# Altium schematic sheet DAC.SchDoc
size A4
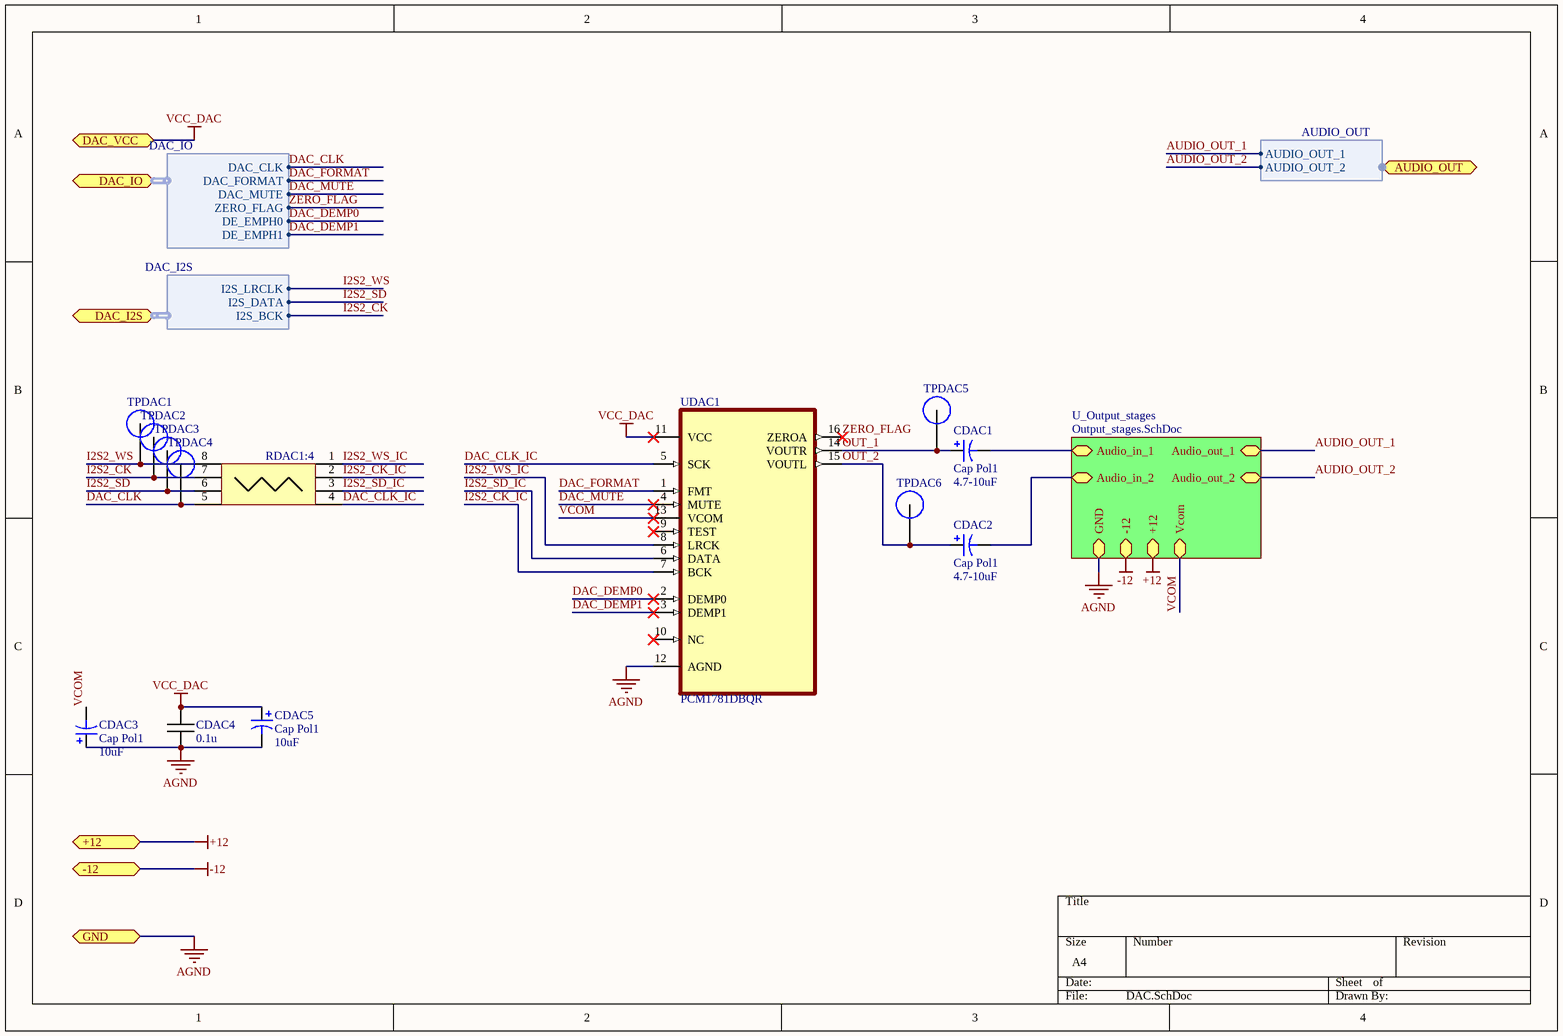
[diagram p0: DAC.SchDoc]

## Parts
CDAC1  Cap Pol1  value 4.7-10uF  [C-RAD-4.5]
CDAC2  Cap Pol1  value 4.7-10uF  [C-RAD-4.5]
CDAC3  Cap Pol1  value 10uF  [C-RAD-4.5]
CDAC4  0.1u  [C 0603 / 1608]
CDAC5  Cap Pol1  value 10uF  [C-RAD-4.5]
RDAC1:4  742C083121JP  [RESARRAY(4x0603)]  (value not drawn)
TPDAC1  Test Point  [Test POint]  (value not drawn)
TPDAC2  Test Point  [Test POint]  (value not drawn)
TPDAC3  Test Point  [Test POint]  (value not drawn)
TPDAC4  Test Point  [Test POint]  (value not drawn)
TPDAC5  Test Point  [Test POint]  (value not drawn)
TPDAC6  Test Point  [Test POint]  (value not drawn)
UDAC1  PCM1781DBQR  [SOP16-63P600X175-16N]

## Sub-sheets
U_Output_stages = Output_stages.SchDoc: GND (bidir), -12 (bidir), +12 (bidir), Audio_in_1 (bidir), Audio_in_2 (bidir), Vcom (bidir), Audio_out_1 (bidir), Audio_out_2 (bidir)

## Ports
+12 (bidir), -12 (bidir), AUDIO_OUT (bidir, harness AUDIO_OUT), DAC_I2S (bidir, harness DAC_I2S), DAC_IO (bidir, harness DAC_IO), DAC_VCC (bidir), GND (bidir)

## Harnesses
DAC_IO: DAC_CLK, DAC_FORMAT, DAC_MUTE, ZERO_FLAG, DE_EMPH0, DE_EMPH1
AUDIO_OUT: AUDIO_OUT_1, AUDIO_OUT_2
DAC_I2S: I2S_LRCLK, I2S_DATA, I2S_BCK

## Nets
+12: port +12, sheet U_Output_stages/+12
-12: port -12, sheet U_Output_stages/-12
AGND: CDAC3.1 CDAC4.2 CDAC5.2 UDAC1.12(AGND) ; port GND, sheet U_Output_stages/GND
VCC_DAC: CDAC4.1 CDAC5.1 UDAC1.11(VCC) ; port DAC_VCC
AUDIO_OUT_1: sheet U_Output_stages/Audio_out_1, port AUDIO_OUT.AUDIO_OUT_1
AUDIO_OUT_2: sheet U_Output_stages/Audio_out_2, port AUDIO_OUT.AUDIO_OUT_2
DAC_CLK: RDAC1:4.5 TPDAC4.1 ; port DAC_IO.DAC_CLK
DAC_CLK_IC: RDAC1:4.4 UDAC1.5(SCK)
DAC_DEMP0: UDAC1.2(DEMP0) ; port DAC_IO.DE_EMPH0
DAC_DEMP1: UDAC1.3(DEMP1) ; port DAC_IO.DE_EMPH1
DAC_FORMAT: UDAC1.1(FMT) ; port DAC_IO.DAC_FORMAT
DAC_MUTE: UDAC1.4(MUTE) ; port DAC_IO.DAC_MUTE
I2S2_CK: RDAC1:4.7 TPDAC2.1 ; port DAC_I2S.I2S_BCK
I2S2_CK_IC: RDAC1:4.2 UDAC1.7(BCK)
I2S2_SD: RDAC1:4.6 TPDAC3.1 ; port DAC_I2S.I2S_DATA
I2S2_SD_IC: RDAC1:4.3 UDAC1.6(DATA)
I2S2_WS: RDAC1:4.8 TPDAC1.1 ; port DAC_I2S.I2S_LRCLK
I2S2_WS_IC: RDAC1:4.1 UDAC1.8(LRCK)
OUT_1: CDAC1.1 TPDAC5.1 UDAC1.14(VOUTR)
OUT_2: CDAC2.1 TPDAC6.1 UDAC1.15(VOUTL)
VCOM: CDAC3.2 UDAC1.13(VCOM) ; sheet U_Output_stages/Vcom
ZERO_FLAG: UDAC1.16(ZEROA) ; port DAC_IO.ZERO_FLAG
NetCDAC1_2: CDAC1.2 ; sheet U_Output_stages/Audio_in_1
NetCDAC2_2: CDAC2.2 ; sheet U_Output_stages/Audio_in_2

Not connected (* = marked no-connect by the designer): UDAC1 9(TEST)* 10(NC)*

## Library data of the parts
CDAC1-CDAC3 CDAC5 = Cap Pol1: Polarized Capacitor (Radial); Published: 8-Jun-2000; LatestRevisionDate: 17-Jul-2002; LatestRevisionNote: Re-released for DXP Platform.; PackageReference: RB7.6-15; Publisher: Altium Limited; PackageDescription: Polarized Capacitor (Radial); 2 Leads
CDAC4 = Capacitor: Value: 0.1u
RDAC1:4 = Resistor Array 4x: Res Thick Film Array 120 Ohm 5% 1/4W Â±200ppm/Â°C ISOL Molded 8-Pin 1206_4 X 0603_ Concave SMD Paper T/R; MF: CTS Resistor; Availability: Unavailable; SnapEDA_Link: https://www.snapeda.com/parts/742C083121JP/CTS%20Resistor%20Products/view-part/?ref=snap; Price: None; Package: 1206 CTS Components; MP: 742C083121JP; Value: *
UDAC1 = PCM1781DBQR: Converters - Digital to Analog _DAC_ 24-Bit, 192kHz, Ster Delta-Sig Audio DAC; MF: Texas Instruments; Price: None; Value: *; Package: SSOP-16 Texas Instruments; SnapEDA_Link: https://www.snapeda.com/parts/PCM1781DBQR/Texas%20Instruments/view-part/547789/?ref=snap; MP: PCM1781DBQR; Availability: Unavailable